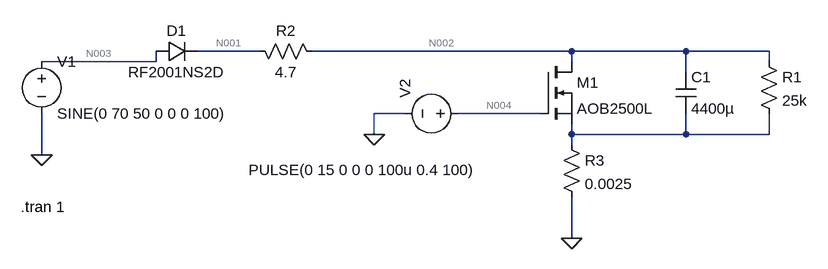
[diagram p0: schematic ChargeCapacitor.asc]
ChargeCapacitor.asc, the LTspice schematic file:
Version 4.1
SHEET 1 880 680
WIRE -64 128 -160 128
WIRE 416 128 16 128
WIRE 592 128 416 128
WIRE 720 128 592 128
WIRE -224 144 -224 128
WIRE -224 144 -400 144
WIRE 416 144 416 128
WIRE 720 144 720 128
WIRE 592 160 592 128
WIRE 160 224 112 224
WIRE 368 224 240 224
WIRE 112 256 112 224
WIRE 416 256 416 240
WIRE 592 256 592 224
WIRE 592 256 416 256
WIRE 720 256 720 224
WIRE 720 256 592 256
WIRE 416 272 416 256
WIRE -400 288 -400 224
WIRE 416 416 416 352
FLAG 416 416 0
FLAG -400 288 0
FLAG 112 256 0
SYMBOL res 704 128 R0
SYMATTR InstName R1
SYMATTR Value 25k
SYMBOL res -80 112 M90
WINDOW 0 0 56 VBottom 2
WINDOW 3 32 56 VTop 2
SYMATTR InstName R2
SYMATTR Value 4.7
SYMBOL cap 576 160 R0
SYMATTR InstName C1
SYMATTR Value 4400µ
SYMBOL nmos 368 144 R0
SYMATTR InstName M1
SYMATTR Value AOB2500L
SYMBOL res 400 256 R0
SYMATTR InstName R3
SYMATTR Value 0.0025
SYMBOL diode -224 112 M90
WINDOW 0 0 32 VBottom 2
WINDOW 3 32 32 VTop 2
SYMATTR InstName D1
SYMATTR Value RF2001NS2D
SYMBOL voltage -400 128 R0
WINDOW 123 0 0 Left 0
WINDOW 39 0 0 Left 0
SYMATTR InstName V1
SYMATTR Value SINE(0 70 50 0 0 0 100)
SYMBOL voltage 256 224 M270
WINDOW 0 24 96 Left 2
WINDOW 3 -87 337 VLeft 2
WINDOW 123 0 0 Left 0
WINDOW 39 0 0 Left 0
SYMATTR InstName V2
SYMATTR Value PULSE(0 15 0 0 0 100u 0.4 100)
TEXT -432 368 Left 2 !.tran 1

The netlist it stands for:
* ChargeCapacitor.asc
R1 N002 N005 25k
R2 N001 N002 4.7
C1 N002 N005 4400µ
M1 N002 N004 N005 N005 AOB2500L
R3 N005 0 0.0025
D1 N003 N001 RF2001NS2D
V1 N003 0 SINE(0 70 50 0 0 0 100)
V2 N004 0 PULSE(0 15 0 0 0 100u 0.4 100)
.model D D
.lib standard.dio
.model NMOS NMOS
.model PMOS PMOS
.lib standard.mos
.tran 1
.backanno
.end

* Results of the author's LTspice run, read from the files saved beside the schematic
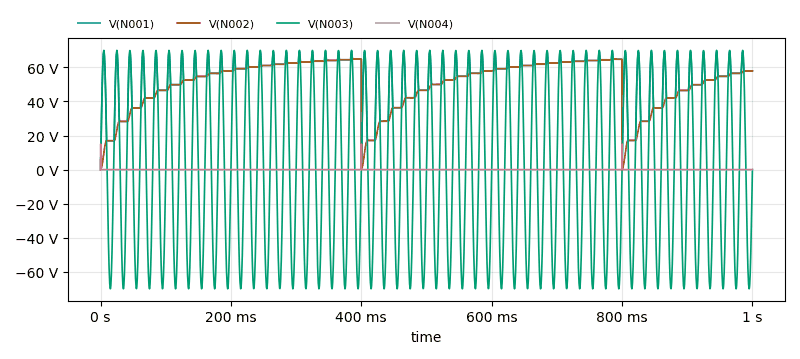
[diagram p1: Transient Analysis of ChargeCapacitor.asc, plotted from the saved traces]
* Transient Analysis, 1 run:
*   V(N001): min 0 V, max 69.3 V, average 54.51 V, rms 55.98 V, last 57.96 V
*   V(N002): min 0 V, max 64.86 V, average 50.63 V, rms 52.67 V, last 57.96 V
*   V(N003): min -70 V, max 70 V, average 26.39 mV, rms 49.57 V, last 0 V
*   V(N004): min 0 V, max 15 V, average 4.95 mV, rms 268.6 mV, last 0 V